# Altium schematic sheet 96kHz_LPF.SchDoc
size A; SheetNumber: 4; SheetTotal: 6
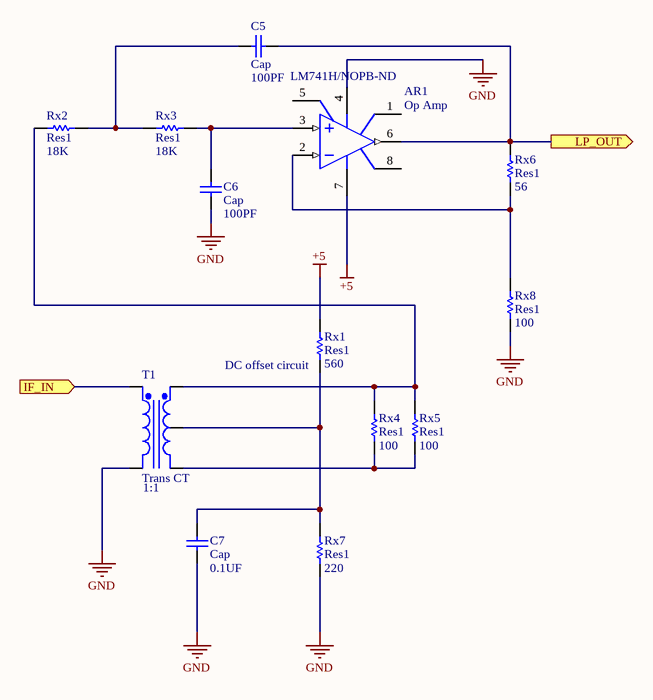
[diagram p0: 96kHz_LPF.SchDoc]

## Parts
AR1  Op Amp  Supplier Part Number 1: LM741H/NOPB-ND  [H-08A]
C5  Cap  value 100PF  [RADIAL-0.1]
C6  Cap  value 100PF  [RADIAL-0.1]
C7  Cap  value 0.1UF  [RADIAL-0.1]
Rx1  Res1  value 560  [AXIAL-0.1-RES]
Rx2  Res1  value 18K  [AXIAL-0.1-RES]
Rx3  Res1  value 18K  [AXIAL-0.1-RES]
Rx4  Res1  value 100  [AXIAL-0.1-RES]
Rx5  Res1  value 100  [AXIAL-0.1-RES]
Rx6  Res1  value 56  [AXIAL-0.1-RES]
Rx7  Res1  value 220  [AXIAL-0.1-RES]
Rx8  Res1  value 100  [AXIAL-0.1-RES]
T1  Trans CT  [BIFILAR-2402]

## Ports
IF_IN (in), LP_OUT (out)

## Nets
+5: AR1.7(V+) Rx1.2
GND: AR1.4(V-) C6.1 C7.1 Rx7.1 Rx8.1 T1.5(Pri-)
IF_IN: T1.4(Pri+) ; port IF_IN
LP_OUT: AR1.6(OUT) C5.2 Rx6.2 ; port LP_OUT
NetAR1_2: AR1.2(IN-) Rx6.1 Rx8.2
NetAR1_3: AR1.3(IN+) C6.2 Rx3.2
NetC5_1: C5.1 Rx2.2 Rx3.1
NetC7_2: C7.2 Rx1.1 Rx7.2 T1.2(SecCT)
NetRx2_1: Rx2.1 Rx4.2 Rx5.2 T1.1(Sec+)
NetRx4_1: Rx4.1 Rx5.1 T1.3(Sec-)

Not connected (* = marked no-connect by the designer): AR1 1(OS_NUL) 5(OS_NUL) 8(TAB)

## Notes on the sheet
- (near Rx1) DC offset circuit
- (near T1) 1:1

## Library data of the parts
AR1 = Op Amp: FET Operational Amplifier; Published: 8-Jun-2000; LatestRevisionDate: 17-Jul-2002; LatestRevisionNote: Re-released for DXP Platform.; DatasheetVersion: REV. B; PackageVersion: 1990; PackageReference: H-08A; Publisher: Altium Limited; PackageDescription: Can; 8 Leads; Pin Circle Dia. 5.08 mm; Lead Dia. 0.53 mm (max); ComponentLink1Description: Manufacturer Link; ComponentLink1URL: http://www.analog.com/; Supplier 1: Digi-Key
C5 C6 = CAP CER 100PF 50V C0G/NP0 RADIAL: Capacitor; Manufacturer Part Number: K101K15C0GF53L2; Designator: C?; Voltage Rating: 50V; Published: 8-Jun-2000; LatestRevisionDate: 17-Jul-2002; LatestRevisionNote: Re-released for DXP Platform.; Publisher: Altium Limited
C7 = CAP CER 0.1UF 50V X7R RADIAL: Capacitor; Manufacturer Part Number: K104M15X7RF5TH5; Designator: C?; Voltage Rating: 50V; Published: 8-Jun-2000; LatestRevisionDate: 17-Jul-2002; LatestRevisionNote: Re-released for DXP Platform.; Publisher: Altium Limited
Rx1 = RES 560 OHM 5% 1/4W AXIAL: Resistor; Manufacturer Part Number: CFR-25JB-52-560R; Designator: R?; Power Rating: 1/4W; Tolerance: 0.05; Published: 8-Jun-2000; LatestRevisionDate: 17-Jul-2002; LatestRevisionNote: Re-released for DXP Platform.; Publisher: Altium Limited
Rx2 Rx3 = RES 18K OHM 5% 1/4W AXIAL: Resistor; Manufacturer Part Number: CFR-25JB-52-18K; Designator: R?; Power Rating: 1/4W; Tolerance: 0.05; Published: 8-Jun-2000; LatestRevisionDate: 17-Jul-2002; LatestRevisionNote: Re-released for DXP Platform.; Publisher: Altium Limited
Rx4 Rx5 Rx8 = RES 100 OHM 5% 1/4W AXIAL: Resistor; Manufacturer Part Number: CFR-25JB-52-100R; Designator: R?; Power Rating: 1/4W; Tolerance: 0.05; Published: 8-Jun-2000; LatestRevisionDate: 17-Jul-2002; LatestRevisionNote: Re-released for DXP Platform.; Publisher: Altium Limited
Rx6 = RES 56 OHM 5% 1/4W AXIAL: Resistor; Manufacturer Part Number: CFR-25JB-52-56R; Designator: R?; Power Rating: 1/4W; Tolerance: 0.05; Published: 8-Jun-2000; LatestRevisionDate: 17-Jul-2002; LatestRevisionNote: Re-released for DXP Platform.; Publisher: Altium Limited
Rx7 = RES 220 OHM 5% 1/4W AXIAL: Resistor; Manufacturer Part Number: CFR-25JB-52-220R; Designator: R?; Power Rating: 1/4W; Tolerance: 0.05; Published: 8-Jun-2000; LatestRevisionDate: 17-Jul-2002; LatestRevisionNote: Re-released for DXP Platform.; Publisher: Altium Limited
T1 = Centre-tapped transformer wound on a binocular core: Center-Tapped Transformer (Coupled Inductor Model); Designator: T?; Published: 8-Jun-2000; LatestRevisionDate: 17-Jul-2002; LatestRevisionNote: Re-released for DXP Platform.; Publisher: Altium Limited